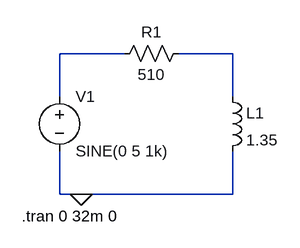
[diagram p0: schematic inductor.asc]
inductor.asc, the LTspice schematic file:
Version 4
SHEET 1 880 680
WIRE 176 32 80 32
WIRE 336 32 256 32
WIRE 80 96 80 32
WIRE 336 96 336 32
WIRE 80 240 80 176
WIRE 112 240 80 240
WIRE 336 240 336 176
WIRE 336 240 112 240
FLAG 112 240 0
SYMBOL voltage 80 80 R0
WINDOW 123 0 0 Left 0
WINDOW 39 0 0 Left 0
SYMATTR InstName V1
SYMATTR Value SINE(0 5 1k)
SYMBOL res 272 16 R90
WINDOW 0 0 56 VBottom 2
WINDOW 3 32 56 VTop 2
SYMATTR InstName R1
SYMATTR Value 510
SYMBOL ind 320 80 R0
SYMATTR InstName L1
SYMATTR Value 1.35
TEXT 24 272 Left 2 !.tran 0 32m 0

The netlist it stands for:
* inductor.asc
V1 N001 0 SINE(0 5 1k)
R1 N002 N001 510
L1 N002 0 1.35
.tran 0 32m 0
.backanno
.end